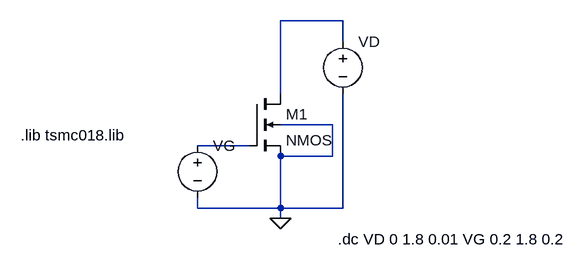
[diagram p0: schematic 180n_IDVD.asc]
180n_IDVD.asc, the LTspice schematic file:
Version 4
SHEET 1 880 680
WIRE 320 16 224 16
WIRE 320 48 320 16
WIRE 224 128 224 16
WIRE 304 176 224 176
WIRE 176 208 96 208
WIRE 304 224 304 176
WIRE 304 224 224 224
WIRE 96 304 96 288
WIRE 224 304 224 224
WIRE 224 304 96 304
WIRE 320 304 320 128
WIRE 320 304 224 304
WIRE 224 320 224 304
FLAG 224 320 0
SYMBOL nmos4 176 128 R0
SYMATTR InstName M1
SYMATTR Value2 l=180n w=270n
SYMBOL voltage 96 192 R0
WINDOW 123 0 0 Left 0
WINDOW 39 0 0 Left 0
SYMATTR InstName VG
SYMATTR Value ""
SYMBOL voltage 320 32 R0
WINDOW 123 0 0 Left 0
WINDOW 39 0 0 Left 0
SYMATTR InstName VD
SYMATTR Value ""
TEXT -176 192 Left 2 !.lib tsmc018.lib
TEXT 312 352 Left 2 !.dc VD 0 1.8 0.01 VG 0.2 1.8 0.2

The netlist it stands for:
* 180n_IDVD.asc
M1 N001 N002 0 0 NMOS l=180n w=270n
VG N002 0
VD N001 0
.model NMOS NMOS
.model PMOS PMOS
.lib standard.mos
.lib tsmc018.lib
.dc VD 0 1.8 0.01 VG 0.2 1.8 0.2
.backanno
.end